# Altium schematic sheet VGA.SchDoc (part 3 of 3)
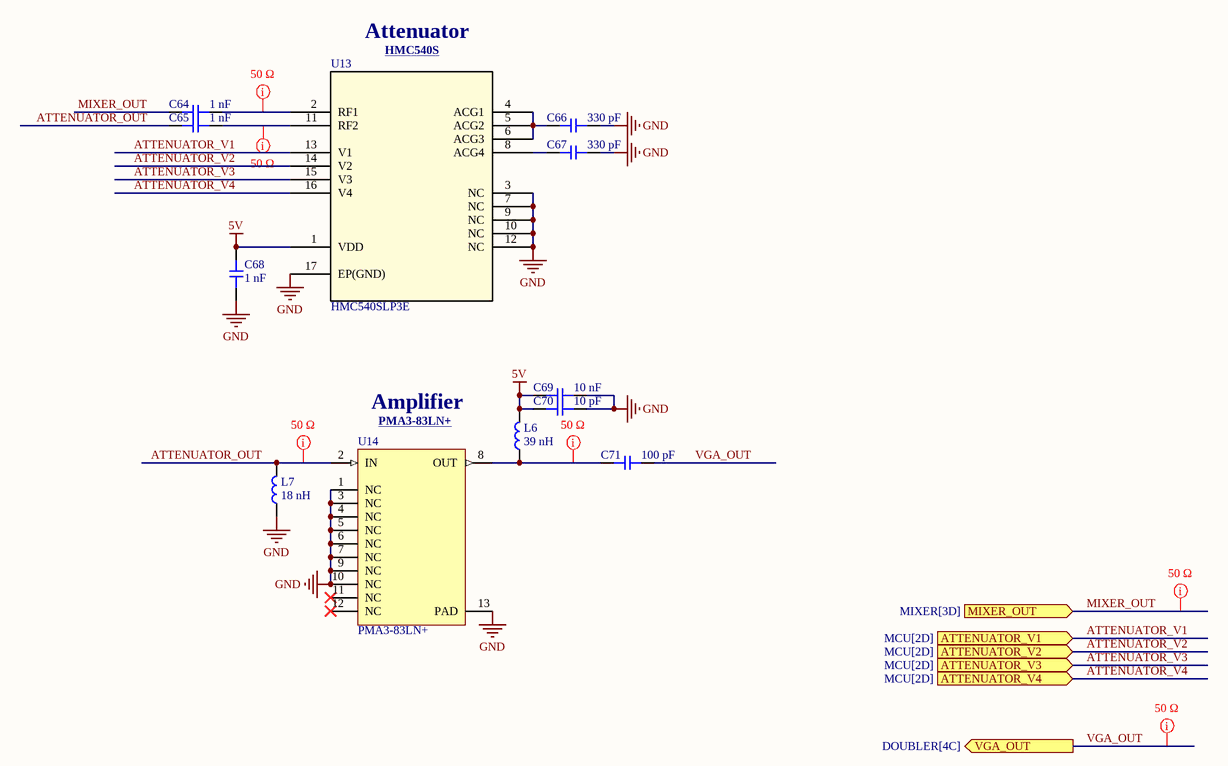
[diagram p2: VGA.SchDoc]

## Library data of the parts (continued)
U14 = PMA3-83LN+: 1.3dB 0.5GHz~8GHz 21.3dB , LTE, SATCOM, UMTS, WiFi, WiMAX, WLAN QFN-12-EP(3x3) RF Amplifiers ROHS; Manufacturer: Mini-Circuits; Bandwidth: 7.5GHz; Gain: 19.9dB; Impedance: 50Ω; Clock Frequency: 8GHz; Max Junction Temperature (Tj): 150°C; Max Power Dissipation: 950mW; Max Supply Voltage: 6V; Noise Figure: 2.2dB; P1dB: 18dBm; Manufacturer Part Number: PMA3-83LN+; Supplier: DigiKey; Supplier Part Number: 3157-PMA3-83LN+CT-ND; RoHS: Compliant; Category: RF Amplifiers; Stock: 11975; Pricing: 1=23.6, 20=18.852, 50=15.696, 100=14.124, 200=12.43205, 500=11.36404, 2000=9.60007 (USD); Export Control Classification Number (ECCN) Code: EAR99; Height: 990.6µm; Introduction Date: 2015-09-21; Lifecycle Status: Production; Max Operating Temperature: 105°C; Min Operating Temperature: -40°C; REACH SVHC: Yes; ComponentLink1URL: https://datasheet.octopart.com:443/PMA3-83LN%2B-Mini-Circuits-datasheet-180702334.pdf?src-supplier=IHS; ComponentLink1Description: https://datasheet.octopart.com:443/PMA3-83LN%2B-Mini-Circuits-datasheet-180702334.pdf?src-supplier=IHS; ComponentLink2URL: https://datasheet.octopart.com:443/PMA3-83LN%2B-Mini-Circuits-datasheet-86645527.pdf?src-supplier=Upverter; ComponentLink2Description: https://datasheet.octopart.com:443/PMA3-83LN%2B-Mini-Circuits-datasheet-86645527.pdf?src-supplier=Upverter; ComponentLink3URL: https://sigma.octopart.com:443/153600622/technical_drawing/Mini-Circuits-PMA3-83LN%2B.pdf?src-supplier=Upverter; ComponentLink3Description: https://sigma.octopart.com:443/153600622/technical_drawing/Mini-Circuits-PMA3-83LN%2B.pdf?src-supplier=Upverter